# Altium schematic sheet Power_PCB.SchDoc
size A3; SheetNumber: 2; PageSetup: Record=PageOptions|CenterHorizontal=True|CenterVertical=True|PrintScale=1.00|XCorrection=1.00|YCorrection=1.00|PrintKind=1|BorderSize=5000000|LeftOffset=0|BottomOffset=0|Orientation=2|PaperLength=4200|PaperWidth=2970|Scale=100|PaperSource=256|PrintQuality=600|MediaType=0|DitherType=0|PaperKind=A3|PrintScaleMode=1
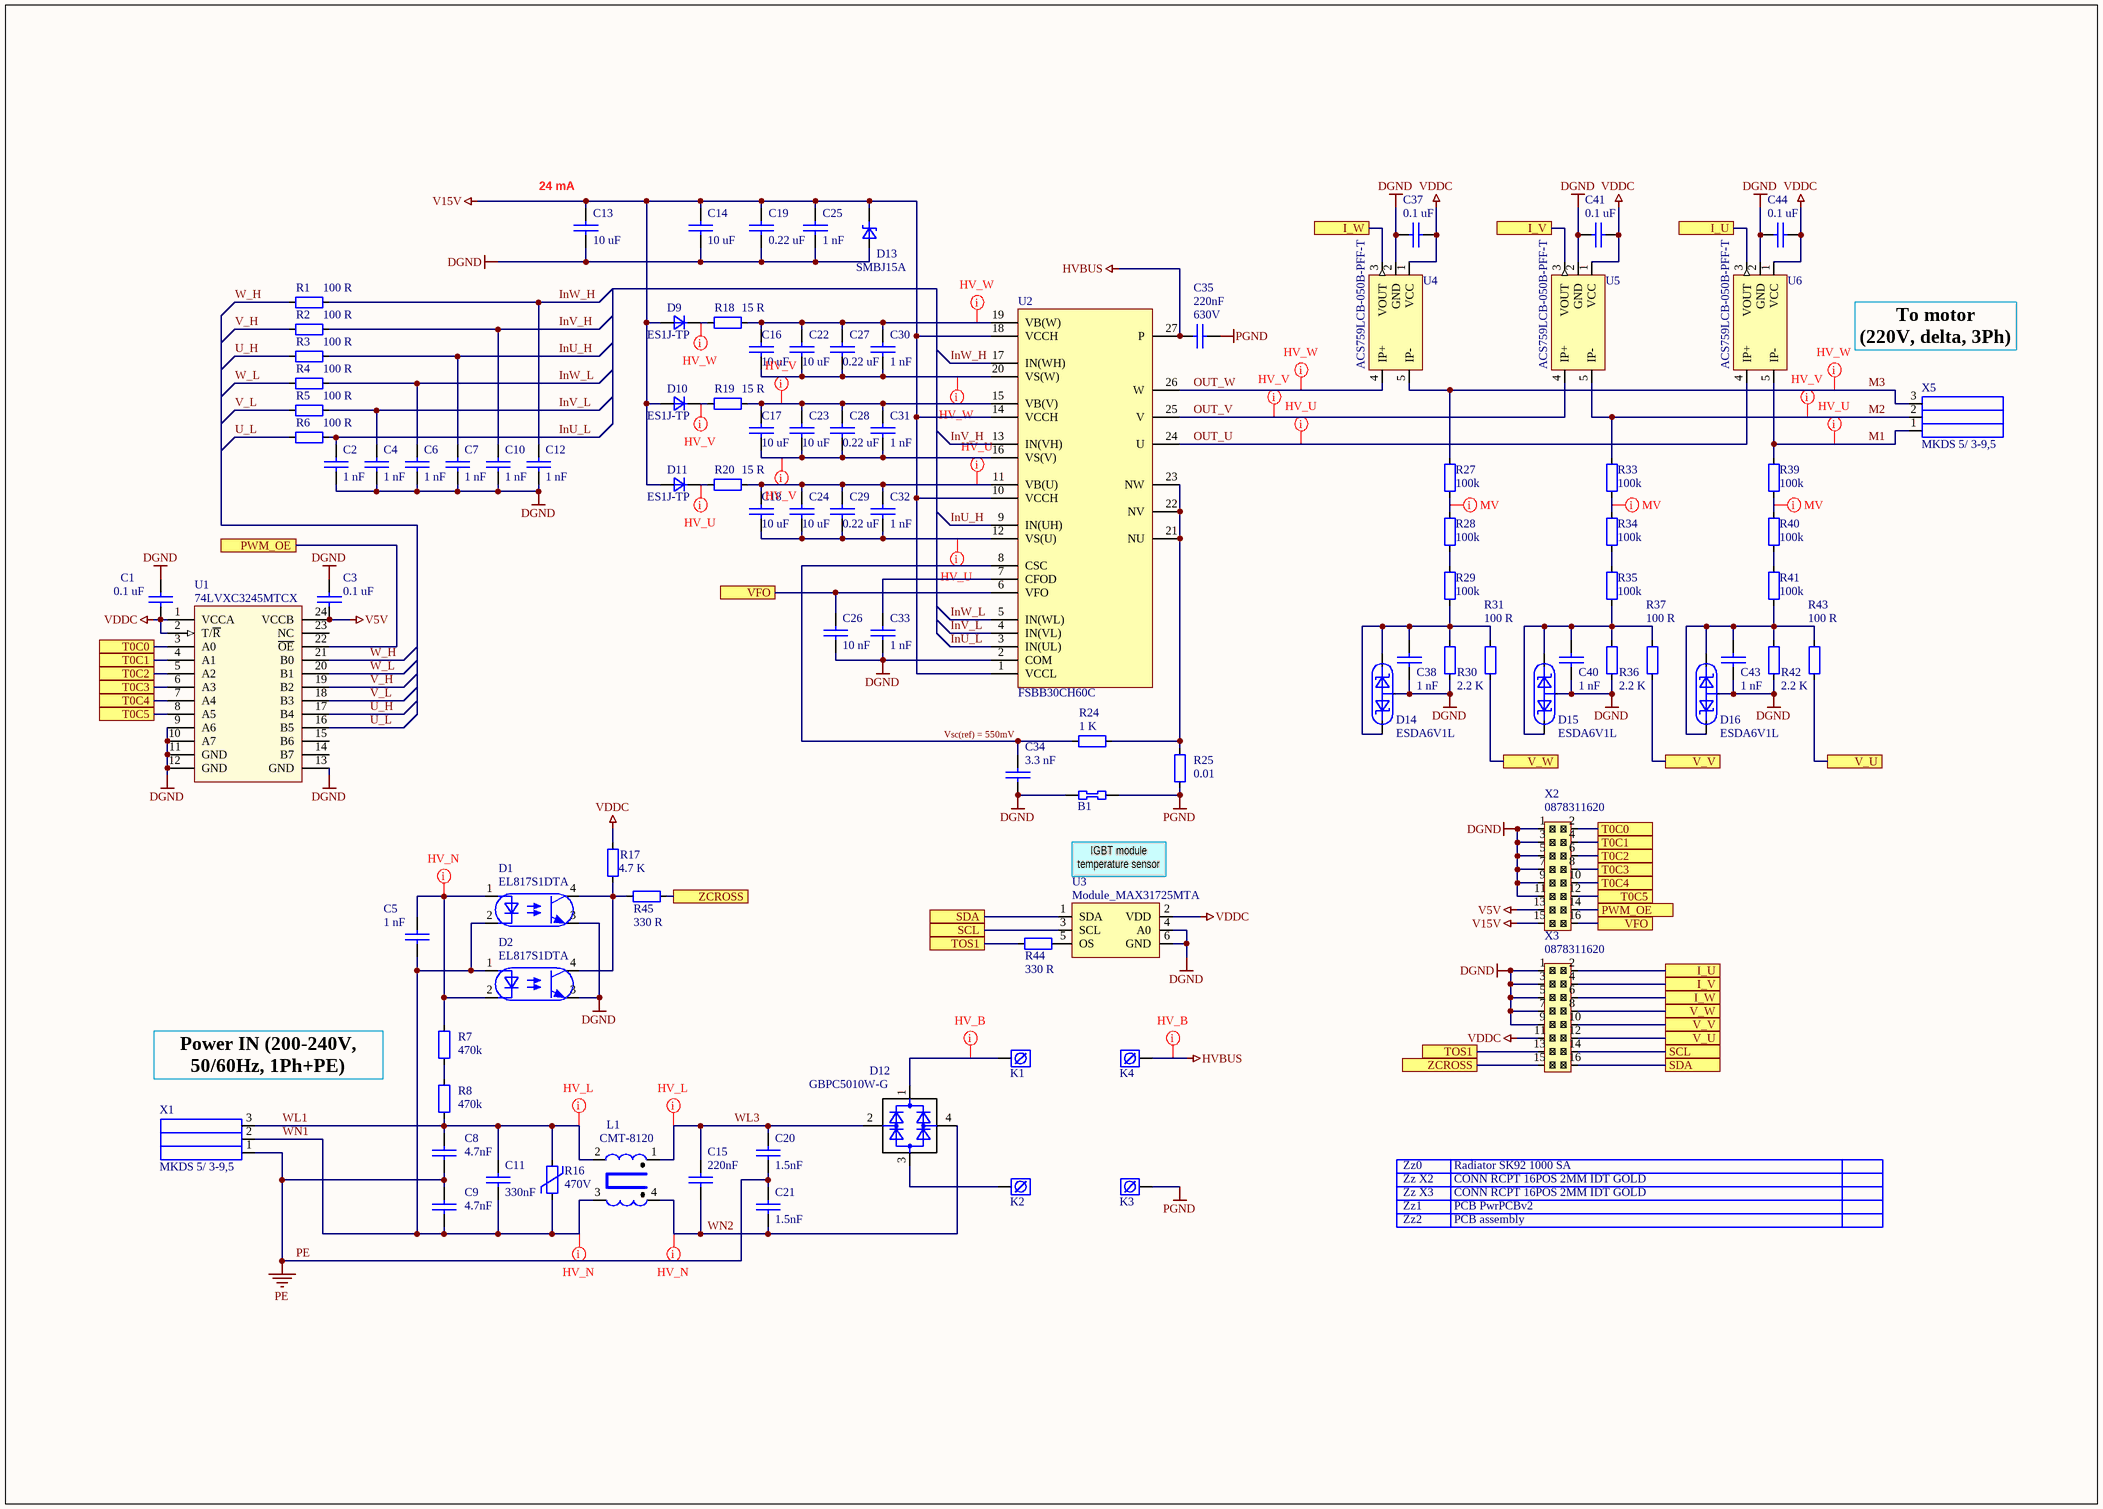
[diagram p0: Power_PCB.SchDoc]

## Parts
B1  Net tie 2 mm  [Net tie 2 mm]  (value not drawn)  (net tie, no BOM)
C1  value 0.1 uF  [1608[0603]]  (hidden comment: CL10B104KA8NNND)
C2  value 1 nF  [1608[0603]]  (hidden comment: CL10B102KB8NNNC)
C3  value 0.1 uF  [1608[0603]]  (hidden comment: CL10B104KA8NNND)
C4  value 1 nF  [1608[0603]]  (hidden comment: CL10B102KB8NNNC)
C5  value 1 nF  [1608[0603]]  (hidden comment: CL10B102KB8NNNC)
C6  value 1 nF  [1608[0603]]  (hidden comment: CL10B102KB8NNNC)
C7  value 1 nF  [1608[0603]]  (hidden comment: CL10B102KB8NNNC)
C8  value 4.7nF  [DE2E3KH472M]  (hidden comment: DE2E3KH472MA3B)
C9  value 4.7nF  [DE2E3KH472M]  (hidden comment: DE2E3KH472MA3B)
C10  value 1 nF  [1608[0603]]  (hidden comment: CL10B102KB8NNNC)
C11  value 330nF  [JFV-330N/275-P15]  (hidden comment: JFV-330N/275-P15)
C12  value 1 nF  [1608[0603]]  (hidden comment: CL10B102KB8NNNC)
C13  value 10 uF  [3225[1210]]  (hidden comment: UMK325BJ106KM-T)
C14  value 10 uF  [3225[1210]]  (hidden comment: UMK325BJ106KM-T)
C15  value 220nF  [JFV-220N/275-P15]  (hidden comment: JFV-220N/275-P15)
C16  value 10 uF  [3225[1210]]  (hidden comment: UMK325BJ106KM-T)
C17  value 10 uF  [3225[1210]]  (hidden comment: UMK325BJ106KM-T)
C18  value 10 uF  [3225[1210]]  (hidden comment: UMK325BJ106KM-T)
C19  value 0.22 uF  [2012[0805]]  (hidden comment: C0805C224K5RACTU)
C20  value 1.5nF  [CY2V-1N5]  (hidden comment: CY2V-1N5)
C21  value 1.5nF  [CY2V-1N5]  (hidden comment: CY2V-1N5)
C22  value 10 uF  [3225[1210]]  (hidden comment: UMK325BJ106KM-T)
C23  value 10 uF  [3225[1210]]  (hidden comment: UMK325BJ106KM-T)
C24  value 10 uF  [3225[1210]]  (hidden comment: UMK325BJ106KM-T)
C25  value 1 nF  [1608[0603]]  (hidden comment: CL10B102KB8NNNC)
C26  value 10 nF  [1608[0603]]  (hidden comment: CL10B103JB8NNNC)
C27  value 0.22 uF  [2012[0805]]  (hidden comment: C0805C224K5RACTU)
C28  value 0.22 uF  [2012[0805]]  (hidden comment: C0805C224K5RACTU)
C29  value 0.22 uF  [2012[0805]]  (hidden comment: C0805C224K5RACTU)
C30  value 1 nF  [1608[0603]]  (hidden comment: CL10B102KB8NNNC)
C31  value 1 nF  [1608[0603]]  (hidden comment: CL10B102KB8NNNC)
C32  value 1 nF  [1608[0603]]  (hidden comment: CL10B102KB8NNNC)
C33  value 1 nF  [1608[0603]]  (hidden comment: CL10B102KB8NNNC)
C34  value 3.3 nF  [1608[0603]]  (hidden comment: CL10B332KB8NNNC)
C35  value 220nF  Voltage: 630V  [2220]  (hidden comment: GRM55DR72J224KW01L)
C37  value 0.1 uF  [1608[0603]]  (hidden comment: CL10B104KA8NNND)
C38  value 1 nF  [1608[0603]]  (hidden comment: CL10B102KB8NNNC)
C40  value 1 nF  [1608[0603]]  (hidden comment: CL10B102KB8NNNC)
C41  value 0.1 uF  [1608[0603]]  (hidden comment: CL10B104KA8NNND)
C43  value 1 nF  [1608[0603]]  (hidden comment: CL10B102KB8NNNC)
C44  value 0.1 uF  [1608[0603]]  (hidden comment: CL10B104KA8NNND)
D1  EL817S1DTA  [Optoc EL816]
D2  EL817S1DTA  [Optoc EL816]
D9  ES1J-TP  [DO-214AA_SMBJ]
D10  ES1J-TP  [DO-214AA_SMBJ]
D11  ES1J-TP  [DO-214AA_SMBJ]
D12  GBPC5010W-G  [GBPC5010W]
D13  SMBJ15A  [SMB ST]
D14  ESDA6V1L  [SOT23]
D15  ESDA6V1L  [SOT23]
D16  ESDA6V1L  [SOT23]
K1  KEYS7692  [KEYS7692]  (value not drawn)
K2  KEYS7692  [KEYS7692]  (value not drawn)
K3  KEYS7692  [KEYS7692]  (value not drawn)
K4  KEYS7692  [KEYS7692]  (value not drawn)
L1  CMT-8120  [CMT-8120]
R1  value 100 R  [0603]  (hidden comment: ERJ-3EKF1000V)
R2  value 100 R  [0603]  (hidden comment: ERJ-3EKF1000V)
R3  value 100 R  [0603]  (hidden comment: ERJ-3EKF1000V)
R4  value 100 R  [0603]  (hidden comment: ERJ-3EKF1000V)
R5  value 100 R  [0603]  (hidden comment: ERJ-3EKF1000V)
R6  value 100 R  [0603]  (hidden comment: ERJ-3EKF1000V)
R7  value 470k  [CR6332-2512]  (hidden comment: 25121WF0474T4E)
R8  value 470k  [CR6332-2512]  (hidden comment: 25121WF0474T4E)
R16  Voltage: 470V  [ERZ-V14D471]  (hidden comment: ERZV14D471)
R17  value 4.7 K  [0603]  (hidden comment: RJ0603FRE074K7L)
R18  value 15 R  [3216[1206]]  (hidden comment: CRCW120615R0FKEA)
R19  value 15 R  [3216[1206]]  (hidden comment: CRCW120615R0FKEA)
R20  value 15 R  [3216[1206]]  (hidden comment: CRCW120615R0FKEA)
R24  value 1 K  [0603]  (hidden comment: RC0603FR-071KL)
R25  value 0.01  [MCS3264]  (hidden comment: MCS3264R010FER)
R27  value 100k  [3216[1206]]  (hidden comment: ERJ-8ENF1003V)
R28  value 100k  [3216[1206]]  (hidden comment: ERJ-8ENF1003V)
R29  value 100k  [3216[1206]]  (hidden comment: ERJ-8ENF1003V)
R30  value 2.2 K  [0603]  (hidden comment: RC0603FR-072K2L)
R31  value 100 R  [0603]  (hidden comment: ERJ-3EKF1000V)
R33  value 100k  [3216[1206]]  (hidden comment: ERJ-8ENF1003V)
R34  value 100k  [3216[1206]]  (hidden comment: ERJ-8ENF1003V)
R35  value 100k  [3216[1206]]  (hidden comment: ERJ-8ENF1003V)
R36  value 2.2 K  [0603]  (hidden comment: RC0603FR-072K2L)
R37  value 100 R  [0603]  (hidden comment: ERJ-3EKF1000V)
R39  value 100k  [3216[1206]]  (hidden comment: ERJ-8ENF1003V)
R40  value 100k  [3216[1206]]  (hidden comment: ERJ-8ENF1003V)
R41  value 100k  [3216[1206]]  (hidden comment: ERJ-8ENF1003V)
R42  value 2.2 K  [0603]  (hidden comment: RC0603FR-072K2L)
R43  value 100 R  [0603]  (hidden comment: ERJ-3EKF1000V)
R44  value 330 R  [0603]  (hidden comment: RC0603FR-07330RL)
R45  value 330 R  [0603]  (hidden comment: RC0603FR-07330RL)
U1  74LVXC3245MTCX  [TSSOP24 , JEDEC MO-153, Fairchild]
U2  FSBB30CH60C  [FSSB30CH60C]
U3  Module_MAX31725MTA  [TempSensor on MAX31725]
U4  ACS759LCB-050B-PFF-T  [ACS756]
U5  ACS759LCB-050B-PFF-T  [ACS756]
U6  ACS759LCB-050B-PFF-T  [ACS756]
X1  MKDS 5/ 3-9,5  [MKDS 5/ 3-9,5]
X2  0878311620  [8x2, 2.00mm Pitch Milli-Grid™ Header, Molex]
X3  0878311620  [8x2, 2.00mm Pitch Milli-Grid™ Header, Molex]
X5  MKDS 5/ 3-9,5  [MKDS 5/ 3-9,5]
Zz0  Radiator SK92 1000 SA
Zz1  PCB PwrPCBv2
Zz2  PCB assembly
Zz_X2  CONN RCPT 16POS 2MM IDT GOLD
Zz_X3  CONN RCPT 16POS 2MM IDT GOLD

## Ports
I_U, I_V, I_W, PWM_OE, SCL, SDA, T0C0, T0C1, T0C2, T0C3, T0C4, T0C5, TOS1, V_U, V_V, V_W, VFO, ZCROSS

## Nets
DGND: B1.2 C1.2 C2.2 C3.2 C4.2 C6.2 C7.2 C10.2 C12.2 C13.2 C14.2 C19.2 C25.2 C26.1 C33.2 C34.2 C37.2 C38.2 C40.2 C41.2 C43.2 C44.2 D1.3(E) D2.3(E) D13.1 D14.3 D15.3 D16.3 R30.2 R36.2 R42.2 U1.9(A6) U1.10(A7) U1.11(GND) U1.12(GND) U1.13(GND) U2.2(COM) U3.4(A0) U3.6(GND) U4.2(GND) U5.2(GND) U6.2(GND) X2.1 X2.3 X2.5 X2.7 X2.9 X2.11 X3.1 X3.3 X3.5 X3.7 X3.9
HVBUS: C35.1 K4.1 U2.27(P)
PE: C8.2 C9.1 C20.2 C21.1 X1.1
PGND: B1.1 C35.2 K3.1 R25.1
V5V: C3.1 U1.24(VCCB) X2.13
V15V: C13.1 C14.1 C19.1 C25.1 D9.2(A) D10.2(A) D11.2(A) D13.2 U2.1(VCCL) U2.10(VCCH) U2.14(VCCH) U2.18(VCCH) X2.15
VDDC: C1.1 C37.1 C41.1 C44.1 R17.2 U1.1(VCCA) U1.2(T/~{R}) U3.2(VDD) U4.1(VCC) U5.1(VCC) U6.1(VCC) X3.11
I_U: U6.3(VOUT) X3.2 ; port I_U
I_V: U5.3(VOUT) X3.4 ; port I_V
I_W: U4.3(VOUT) X3.6 ; port I_W
InU_H: C7.1 R3.1 U2.9(IN(UH))
InU_L: C2.1 R6.1 U2.3(IN(UL))
InV_H: C10.1 R2.1 U2.13(IN(VH))
InV_L: C4.1 R5.1 U2.4(IN(VL))
InW_H: C12.1 R1.1 U2.17(IN(WH))
InW_L: C6.1 R4.1 U2.5(IN(WL))
M1: R39.1 U6.5(IP-) X5.1
M2: R33.1 U5.5(IP-) X5.2
M3: R27.1 U4.5(IP-) X5.3
OUT_U: U2.24(U) U6.4(IP+)
OUT_V: U2.25(V) U5.4(IP+)
OUT_W: U2.26(W) U4.4(IP+)
PWM_OE: U1.22(~{OE}) X2.14 ; port PWM_OE
SCL: U3.3(SCL) X3.14 ; port SCL
SDA: U3.1(SDA) X3.16 ; port SDA
T0C0: U1.3(A0) X2.2 ; port T0C0
T0C1: U1.4(A1) X2.4 ; port T0C1
T0C2: U1.5(A2) X2.6 ; port T0C2
T0C3: U1.6(A3) X2.8 ; port T0C3
T0C4: U1.7(A4) X2.10 ; port T0C4
T0C5: U1.8(A5) X2.12 ; port T0C5
TOS1: R44.2 X3.13 ; port TOS1
U_H: R3.2 U1.17(B4)
U_L: R6.2 U1.16(B5)
V_H: R2.2 U1.19(B2)
V_L: R5.2 U1.18(B3)
V_U: R43.2 X3.12 ; port V_U
V_V: R37.2 X3.10 ; port V_V
V_W: R31.2 X3.8 ; port V_W
VFO: C26.2 U2.6(VFO) X2.16 ; port VFO
W_H: R1.2 U1.21(B0)
W_L: R4.2 U1.20(B1)
WL1: C8.1 C11.1 L1.2 R8.1 R16.2 X1.3
WL3: C15.1 C20.1 D12.2 L1.1
WN1: C5.2 C9.2 C11.2 D1.2(C) D2.1(A) L1.3 R16.1 X1.2
WN2: C15.2 C21.2 D12.4 L1.4
ZCROSS: R45.1 X3.15 ; port ZCROSS
NetC5_1: C5.1 D1.1(A) D2.2(C) R7.2
NetC16_1: C16.1 C22.1 C27.1 C30.1 R18.2 U2.19(VB(W))
NetC16_2: C16.2 C22.2 C27.2 C30.2 U2.20(VS(W))
NetC17_1: C17.1 C23.1 C28.1 C31.1 R19.2 U2.15(VB(V))
NetC17_2: C17.2 C23.2 C28.2 C31.2 U2.16(VS(V))
NetC18_1: C18.1 C24.1 C29.1 C32.1 R20.2 U2.11(VB(U))
NetC18_2: C18.2 C24.2 C29.2 C32.2 U2.12(VS(U))
NetC33_1: C33.1 U2.7(CFOD)
NetC34_1: C34.1 R24.1 U2.8(CSC)
NetC38_1: C38.1 D14.1 D14.2 R29.2 R30.1 R31.1
NetC40_1: C40.1 D15.1 D15.2 R35.2 R36.1 R37.1
NetC43_1: C43.1 D16.1 D16.2 R41.2 R42.1 R43.1
NetD1_4: D1.4(C) D2.4(C) R17.1 R45.2
NetD9_1: D9.1(C) R18.1
NetD10_1: D10.1(C) R19.1
NetD11_1: D11.1(C) R20.1
NetD12_1: D12.1 K1.1
NetD12_3: D12.3 K2.1
NetR7_1: R7.1 R8.2
NetR24_2: R24.2 R25.2 U2.21(NU) U2.22(NV) U2.23(NW)
NetR27_2: R27.2 R28.1
NetR28_2: R28.2 R29.1
NetR33_2: R33.2 R34.1
NetR34_2: R34.2 R35.1
NetR39_2: R39.2 R40.1
NetR40_2: R40.2 R41.1
NetR44_1: R44.1 U3.5(OS)

Not connected (* = marked no-connect by the designer): U1 14(B7) 15(B6) 23(NC)

## Layout directives
net class HV_U: M1, NetC18_1, NetC18_2, NetD11_1, OUT_U
net class HV_V: M2, NetC17_1, NetC17_2, NetD10_1, OUT_V
net class HV_W: M3, NetC16_1, NetC16_2, NetD9_1, OUT_W
net class MV: NetR27_2, NetR33_2, NetR39_2
net class HV_N: NetC5_1, WN1, WN2
net class HV_L: WL1, WL3
net class HV_B: HVBUS, NetD12_1

## Notes on the sheet
- (near C13) 24 mA
- To motor
  (220V, delta, 3Ph)
- (near C34) Vsc(ref) = 550mV
- IGBT module temperature sensor
- Power IN (200-240V, 50/60Hz, 1Ph+PE)

## Library data of the parts
C1 C3 C37 C41 C44 = CVNF100K0603-25: 0.1 uF, 25V, 10% , X7R,  0603 SMD MLC Capacitor; Manufacturer: SAMSUNG; Tolerance: 10%; Distributor: Future; Price: 0.0026 Euro; Voltage: 25 V; PartNum: CL10B104KA8NNND; PartName: CL10B104KA8NNND; Price50: 0.0026 Euro; Price100: 0.0026 Euro; Price1000: 0.0026 Euro
C2 C4-C7 C10 C12 C25 C30-C33 C38 C40 C43 = CVNF1.0K0603_1: 1 nF, 50V, 10%, X7R, 0603 SMD MLC Capacitor; Manufacturer: SAMSUNG; Tolerance: 10%; Distributor: Future; Price: 0.002$; PartNum: CL10B102KB8NNNC; Voltage: 50 V; PartName: CL10B102KB8NNNC; Price50: 0.002$; Price100: 0.002$; Price1000: 0.002$
C8 C9 = DE2E3KH472MA3B: CAP CER X1,Y2 4700PF 20% 250VAC,  THT 7.5mm; X1,Y2; Manufacturer: Murata; Distributor: TME; PartNum: CMT-8120; Price: 0.622; Link: http://www.tme.eu/lt/details/de2e3kh472ma3b/keraminiai-trukdsiu-slopinimo-kondensat/murata/#; Tolerance: 20%; PartName: DE2E3KH472MA3B; Voltage: 250VAC
C11 = JFV-330N/275-P15: CAP X2, 330nF, 275V, ±10%; 18x10x15.8mm; Manufacturer: JB CAPACITORS; Voltage: 275VAC; Distributor: TME; PartNum: JFV-330N/275-P15; Price: 0.448; Link: http://www.tme.eu/lt/details/jfv-330n_275-p15/polipropileno-kondensatoriai-x2y2/jb-capacitors/#; Tolerance: 10%; PartName: JFV-330N/275-P15
C13 C14 C16-C18 C22-C24 = UMK325BJ106KM-T: 10uF, 50V, 10%, X5R, -55..+85C, 1210; Manufacturer: Taiyo Yuden; PartNum: 587-2247-1-ND; Tolerance: 10%; Distributor: Digi-Key; Price: 0.84$; Voltage: 50V; PartName: UMK325BJ106KM-T; Price50: 0.5$; Price100: 0.44$; Price1000: 0.35$
C15 = JFV-220N/275-P15: CAP X2, 220nF; 15mm; ±10%; 18x6x12mm; Manufacturer: JB CAPACITORS; Voltage: 275VAC; Distributor: TME; PartNum: JFV-220N/275-P15; Price: 0.422; Link: http://www.tme.eu/lt/details/jfv-220n_275-p15/polipropileno-kondensatoriai-x2y2/jb-capacitors/#; Tolerance: 10%; PartName: JFV-220N/275-P15
C19 C27-C29 = C0805C224K5RACTU: 0.22 uF, 50V, X7R,  0805; Manufacturer: Kemet; PartNum: 399-3491-1-ND; Tolerance: +-10%; Distributor: Digi-Key; Price: 0.1$; Voltage: 50 V; PartName: C0805C224K5RACTU
C20 C21 = CY2V-1N5: CAP CER 1500PF 20% 250VAC,  THT 7.5mm;  dimeter 8mm, X1,Y2; Distributor: TME; PartNum: CY2V-1N5; Price: 0.253; Link: http://www.tme.eu/lt/details/cy2v-1n5/keraminiai-trukdsiu-slopinimo-kondensat/#; Tolerance: 20%; PartName: CY2V-1N5; Voltage: 250VAC
C26 = CVNF010K0603: 10 nF, 50V, 5%, X7R, 0603 SMD MLC Capacitor; Manufacturer: SAMSUNG; Tolerance: 5%; Distributor: Future; Price: 0.0045 Euro; PartNum: CL10B103JB8NNNC; Voltage: 50 V; PartName: CL10B103JB8NNNC; Price50: 0.0045 Euro; Price100: 0.0045 Euro; Price1000: 0.0045 Euro
C34 = CVNF3.3K0603_1: 3.3 nF, 50V, 10%, X7R, 0603 SMD MLC Capacitor; Manufacturer: SAMSUNG; Tolerance: 10%; Price: 0.002$; Distributor: Future; PartNum: CL10B332KB8NNNC; Voltage: 50 V; PartName: CL10B332KB8NNNC; Price50: 0.002$; Price100: 0.002$; Price1000: 0.002$
C35 = GRM55DR72J224KW01L: CAP 220NF. X7R, 630V, 2220, 5x5.7x2mm; Manufacturer: Murata Electronics North America; PartNum: 490-3520-1-ND; Tolerance: 10%; Distributor: Digi-Key; PartName: GRM55DR72J224KW01L; Price100: 2.66; Price1000: 1.73; Link: http://lt.farnell.com/murata/grm55dr72j224kw01l/capacitor-2220-x7r-630v-220nf/dp/1828967RL; Price: 1.25$
D1 D2 = EL817S1DTA: Optoc.  5mA >300%, 5kV, SMD4; Manufacturer: EVERLIGHT; PartNum: 638-EL817S1DTA; Price: 0.446$; Distributor: Mouser
D9-D11 = ES1J-TP: DIODE FAST REC 600V 1A DO214AC; Manufacturer: Micro Commercial Co; PartNum: ES1J-TPCT-ND; Price: 0.43$; Distributor: Digi-Key; PartName: ES1J-TP
D12 = GBPC5010W-G: Bridge rectifier; 1000V; 50A; 450Amax, wire 1.07mm; Manufacturer: Comchip Technology; PartNum: 641-1389-ND; Distributor: Digi-Key; Price: 2.8$; PartName: GBPC5010W-G
D13 = SMBJ15A: DIODE TVS 15V 600W UNI 5% SMD; Manufacturer: TAIWAN SEMICONDUCTOR; PartNum: 7277733RL; Distributor: Farnell; Price: 1.77; PartName: SMBJ15A; Value: 15 V
D14-D16 = ESDA6V1L: Dual transil array for ESD, 6.1 V, 300 W; Manufacturer: Micro Commercial Co; PartNum: ESDA6V1L-TPCT-ND; PartName: ESDA6V1L-TP; Distributor: Digi-Key; Price: 0.23$
K1-K4 = KEYS7692: Screw terminal KEYS7692; Manufacturer: KEYSTONE; Distributor: TME; Price: 0.32 Euro; PartNum: KEYS7692; PartName: KEYS7692
L1 = CMT-8120: INDUCTOR 2.4MH COMMON MODE VERT, 17A; Manufacturer: Triad Magnetics; PartNum: 237-1373-ND; Distributor: Digi-Key; Price: 10.96$; Value: 2.4mH; Link: http://www.digikey.com/product-detail/en/CMT-8120/237-1373-ND/2783628; PartName: CMT-8120
R1-R6 R31 R37 R43 = RL0603E100-1_1: 100 R, 1%, 0603, SMD Resistor, Taped; Manufacturer: PANASONIC; Voltage: 75 V; Distributor: Future; Price: 0.0017$; Tolerance: 1%; PartNum: ERJ-3EKF1000V; PartName: ERJ-3EKF1000V; Price50: 0.0015 Euro; Price100: 0.0015 Euro; Price1000: 0.0015 Euro
R7 R8 = 25121WF0474T4E: 470k, 2512, 1W; 200V, ±1%; -55 125°C; Manufacturer: ROYAL OHM; Distributor: TME; PartNum: 25121WF0474T4E; Price: 0.097; Voltage: 200V; Tolerance: 1%; PartName: 25121WF0474T4E
R16 = ERZV14D471: VARISTOR Disc 14mm, 6kA, 175J,; Manufacturer: PANASONIC; Distributor: Farnell; PartNum: ERZV14D471; Price: 2.08; Link: http://lt.farnell.com/jsp/displayProduct.jsp?sku=1845474&action=view&CMP=GRHS-1000755; PartName: ERZV14D471
R17 = RL0603K004.7-1_1: 4.7 K, 1%, 0603, SMD Resistor, Taped; Manufacturer: YAGEO AMERICA CORPORATION; Voltage: 75 V; Distributor: Future; Price: 0.0017$; Tolerance: 1%; PartNum: RJ0603FRE074K7L; PartName: RJ0603FRE074K7L; Price50: 0.0017$; Price100: 0.0017$; Price1000: 0.0017$
R18-R20 = RL1206E015-1: 15 R, 1%,  0.25 W, 200 V, 1206; Manufacturer: Vishay; Voltage: 200V; Distributor: Future; Price: 0.002 Euro; Tolerance: 1%; PartNum: CRCW120615R0FKEA; PartName: CRCW120615R0FKEA
R24 = RL0603K001-1_1: 1 K, 1%, 0603, SMD Resistor, Taped; Manufacturer: YAGEO AMERICA CORPORATION; Voltage: 75 V; Distributor: Future; Price: 0.0017$; Tolerance: 1%; PartNum: RC0603FR-071KL; PartName: RC0603FR-071KL; Price50: 0.0017$; Price100: 0.0017$; Price1000: 0.0017$
R25 = MCS3264R010FER: Curr.sens.res. 0.01 OHM 2W 1% , 2512 (6432 Metric); Manufacturer: Ohmite; PartNum: MCS3264R010FERCT-ND; Distributor: Digi-Key; Price: 0.3$; Tolerance: 1%; PartName: MCS3264R010FER; Price50: 0.3$
R27-R29 R33-R35 R39-R41 = RL1206K100-1: 100K, 1%,  1206,  200v,  SMD 1206; Manufacturer: Panasonic; Distributor: Future; PartNum: ERJ-8ENF1003V; Price: 0.0036Euro; Voltage: 200v; Tolerance: 1%; PartName: ERJ-8ENF1003V
R30 R36 R42 = RL0603K002.2-1_1: 2.2 K, 1%, 0603, SMD Resistor, Taped; Manufacturer: YAGEO AMERICA CORPORATION; Voltage: 75 V; Distributor: Future; Price: 0.0017$; Tolerance: 1%; PartNum: RC0603FR-072K2L; PartName: RC0603FR-072K2L; Price50: 0.0017$; Price100: 0.0017$; Price1000: 0.0017$
R44 R45 = RL0603E330-1_1: 330 R, 1%, 0603, SMD Resistor, Taped; Manufacturer: YAGEO AMERICA CORPORATION; Voltage: 75 V; Distributor: Future; Price: 0.0017$; Tolerance: 1%; PartNum: RC0603FR-07330RL; PartName: RC0603FR-07330RL; Price50: 0.0017$; Price100: 0.0017$; Price1000: 0.0017$
U1 = 74LVXC3245MTCX: TXRX 8BIT DUAL CONF VOLT 24TSSOP; Manufacturer: FAIRCHILD; PartNum: 74LVXC3245MTCXCT-ND; Distributor: Digi-Key; Price: 1.44$; PartName: 74LVXC3245MTCX
U2 = FSBB30CH60C: IGBT module, 600V, 30A, Vcesat 2.0V, 20kHz, SPM27-double DIP; Manufacturer: Infineon; Price: 25.47$; Distributor: Rutronik; PartNum: FSBB30CH60C; Link: http://ru.mouser.com/ProductDetail/Fairchild-Semiconductor/FSBB30CH60CT/?qs=%2fha2pyFaduiTcJDm0nn%252bApUu4Gm%2f%2flPDXM3aJQyqVWlAW602R3O4Bw%3d%3d; PartName: FSBB30CH60C
U3 = Module_MAX31725MTA: IC TEMP SENSOR 8-TDFN; Manufacturer: Barduva; Price: 6$; Distributor: Barduva; PartNum: Module_MAX31725MTA
U4-U6 = ACS759LCB-050B-PFF-T: IC HALL EFFECT SENSOR 50A, 3V; Manufacturer: Allegro Microsystems Inc; PartNum: 620-1467-5-ND; Price: 4.66$; Distributor: DigiKey; PartName: ACS759LCB-050B-PFF-T
X1 X5 = MKDS 5/ 3-9,5: HEADER, VERTICAL, 9.52MM, 3WAY, 32A, 1000V; Manufacturer: PHOENIX CONTACT; PartNum: 1714984; Distributor: PHOENIX CONTACT; Price: 0.92 Euro; PartName: MKDS 5/ 3-9,5
X2 X3 = 0878311620: CONN HEADER 16POS 2MM VERT GOLD; Manufacturer: Molex; PartNum: WM18562-ND; Distributor: Digi-Key; Price: 1.19$; PartName: 0878311620
Zz0 = BOM item: Manufacturer: FISCHER ELEKTRONIK; Distributor: TME; PartName: Radiator SK92 1000 SA; PartNum: Radiator SK92 1000 SA; Price: 40.0
Zz1 = BOM item: Manufacturer: Brandner; PartNum: PwrPCBv2 board; PartName: PwrPCBv2; Price: 11 Euro
Zz2 = BOM item: Manufacturer: ESEMDA; PartNum: PwrPCBv2 assembly; PartName: PCB assembly; Price: 30
Zz_X2 Zz_X3 = BOM item: Manufacturer: Molex Inc; PartName: 0875681694; PartNum: WM8606-ND; Distributor: Digi-Key; Price: 2.39$